# EAGLE design AudioAmplifier (EAGLE 6.5.0)
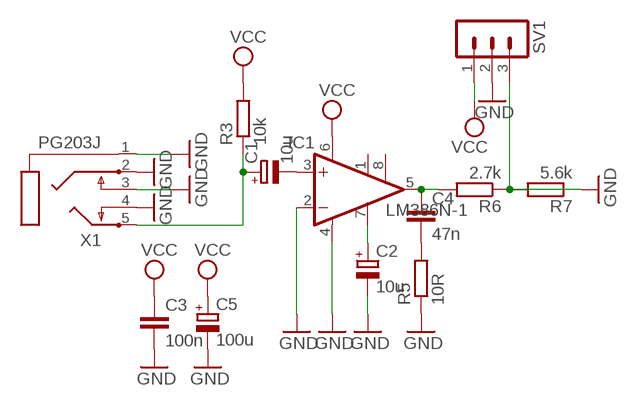
[diagram p0: schematic, sheet 1]

## Parts
C1  10u  CPOL-EUTT2D5  [TT2D5]
C2  10u  CPOL-EUTT2D5  [TT2D5]
C3  100n  C-EU025-024X044  [C025-024X044]
C4  47n  C-EU025-024X044  [C025-024X044]
C5  100u  CPOL-EUTT2D5  [TT2D5]
IC1  LM386N-1  [DIL08]
R3  10k  R-EU_0204/7  [0204/7]
R5  10R  R-EU_0207/2V  [0207/2V]
R6  2.7k  R-EU_0207/2V  [0207/2V]
R7  5.6k  R-EU_0207/2V  [0207/2V]
SV1  MA03-1  [MA03-1]
X1  PG203J  [PG203J]

## Nets
GND: C2.- C3.2 C5.- IC1.2(-IN) IC1.4(GND) R5.1 R7.2 SV1.2 X1.1 X1.2 X1.3 X1.4
N$1: R6.1 R7.1 SV1.3
N$28: C1.- IC1.3(+IN)
N$101: C2.+ IC1.7(BYPASS)
N$102: C4.1 IC1.5(OUT) R6.2
N$103: C4.2 R5.2
N$105: C1.+ R3.1 X1.5
VCC: C3.1 C5.+ IC1.6(VS) R3.2 SV1.1
Unconnected: IC1.1(GAIN) IC1.8(GAIN)

## Library data of the parts
C1 C2 C5 = rcl:CPOL-EU: POLARIZED CAPACITOR, European symbol
C3 C4 = resistor:C-EU: CAPACITOR, European symbol
IC1 = linear:LM386?-*: Low Voltage Audio Power Amplifier Source: http://cache.national.com/ds/LM/LM386.pdf
R3 R5-R7 = resistor:R-EU_: RESISTOR, European symbol
SV1 = con-lstb:MA03-1: PIN HEADER; OC_FARNELL: unknown; OC_NEWARK: unknown
X1 = con-hirschmann:PG203J: MIC/HEADPHONE JACK KS-S stereo microphone/headphone jack PG203JN (Schukat); OC_FARNELL: unknown; OC_NEWARK: unknown

## Net classes
0 default: width 0.305 mm, clearance 0.205 mm

## Board
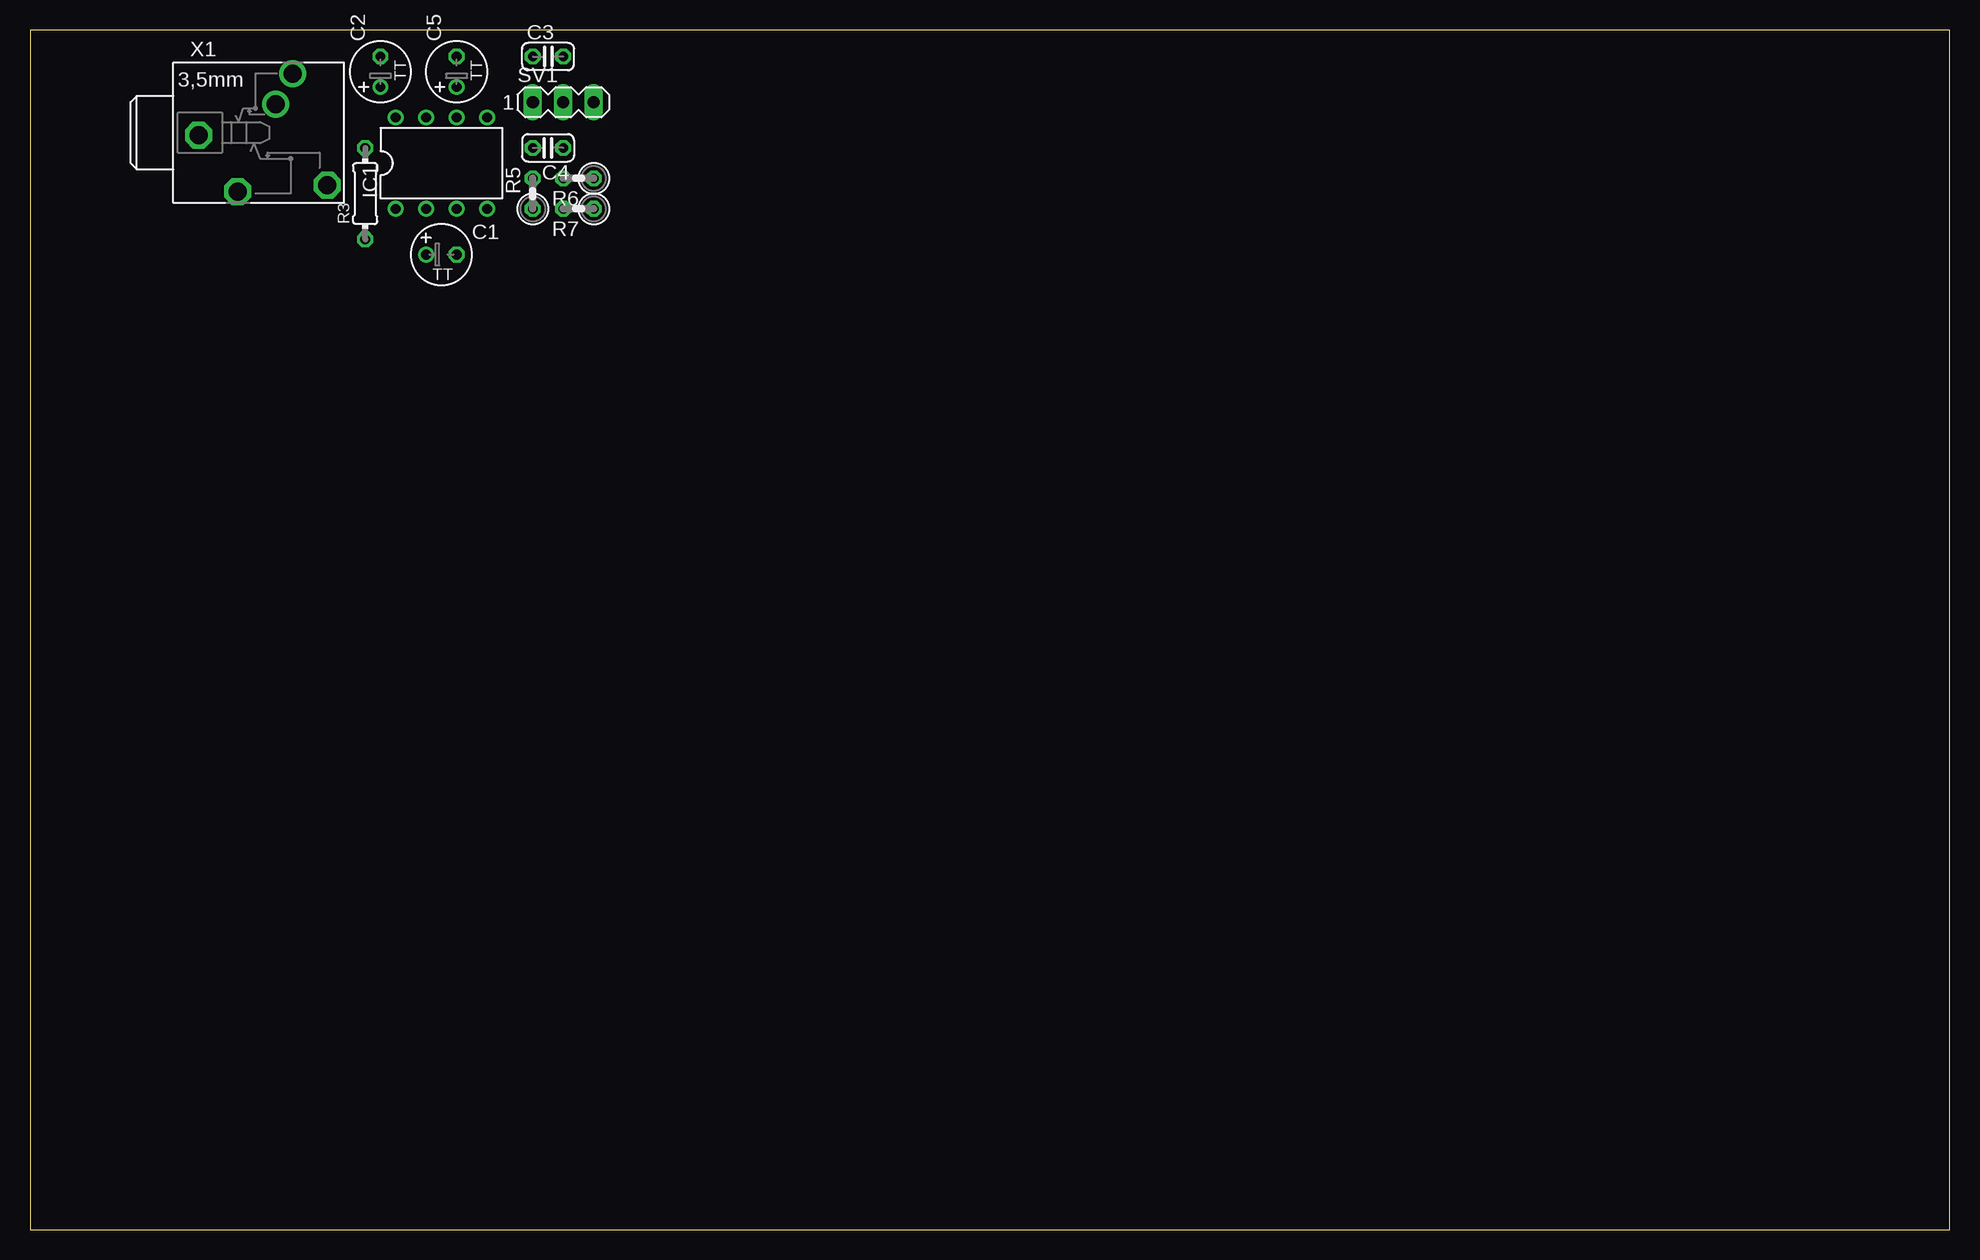
[diagram p1: board, top side]
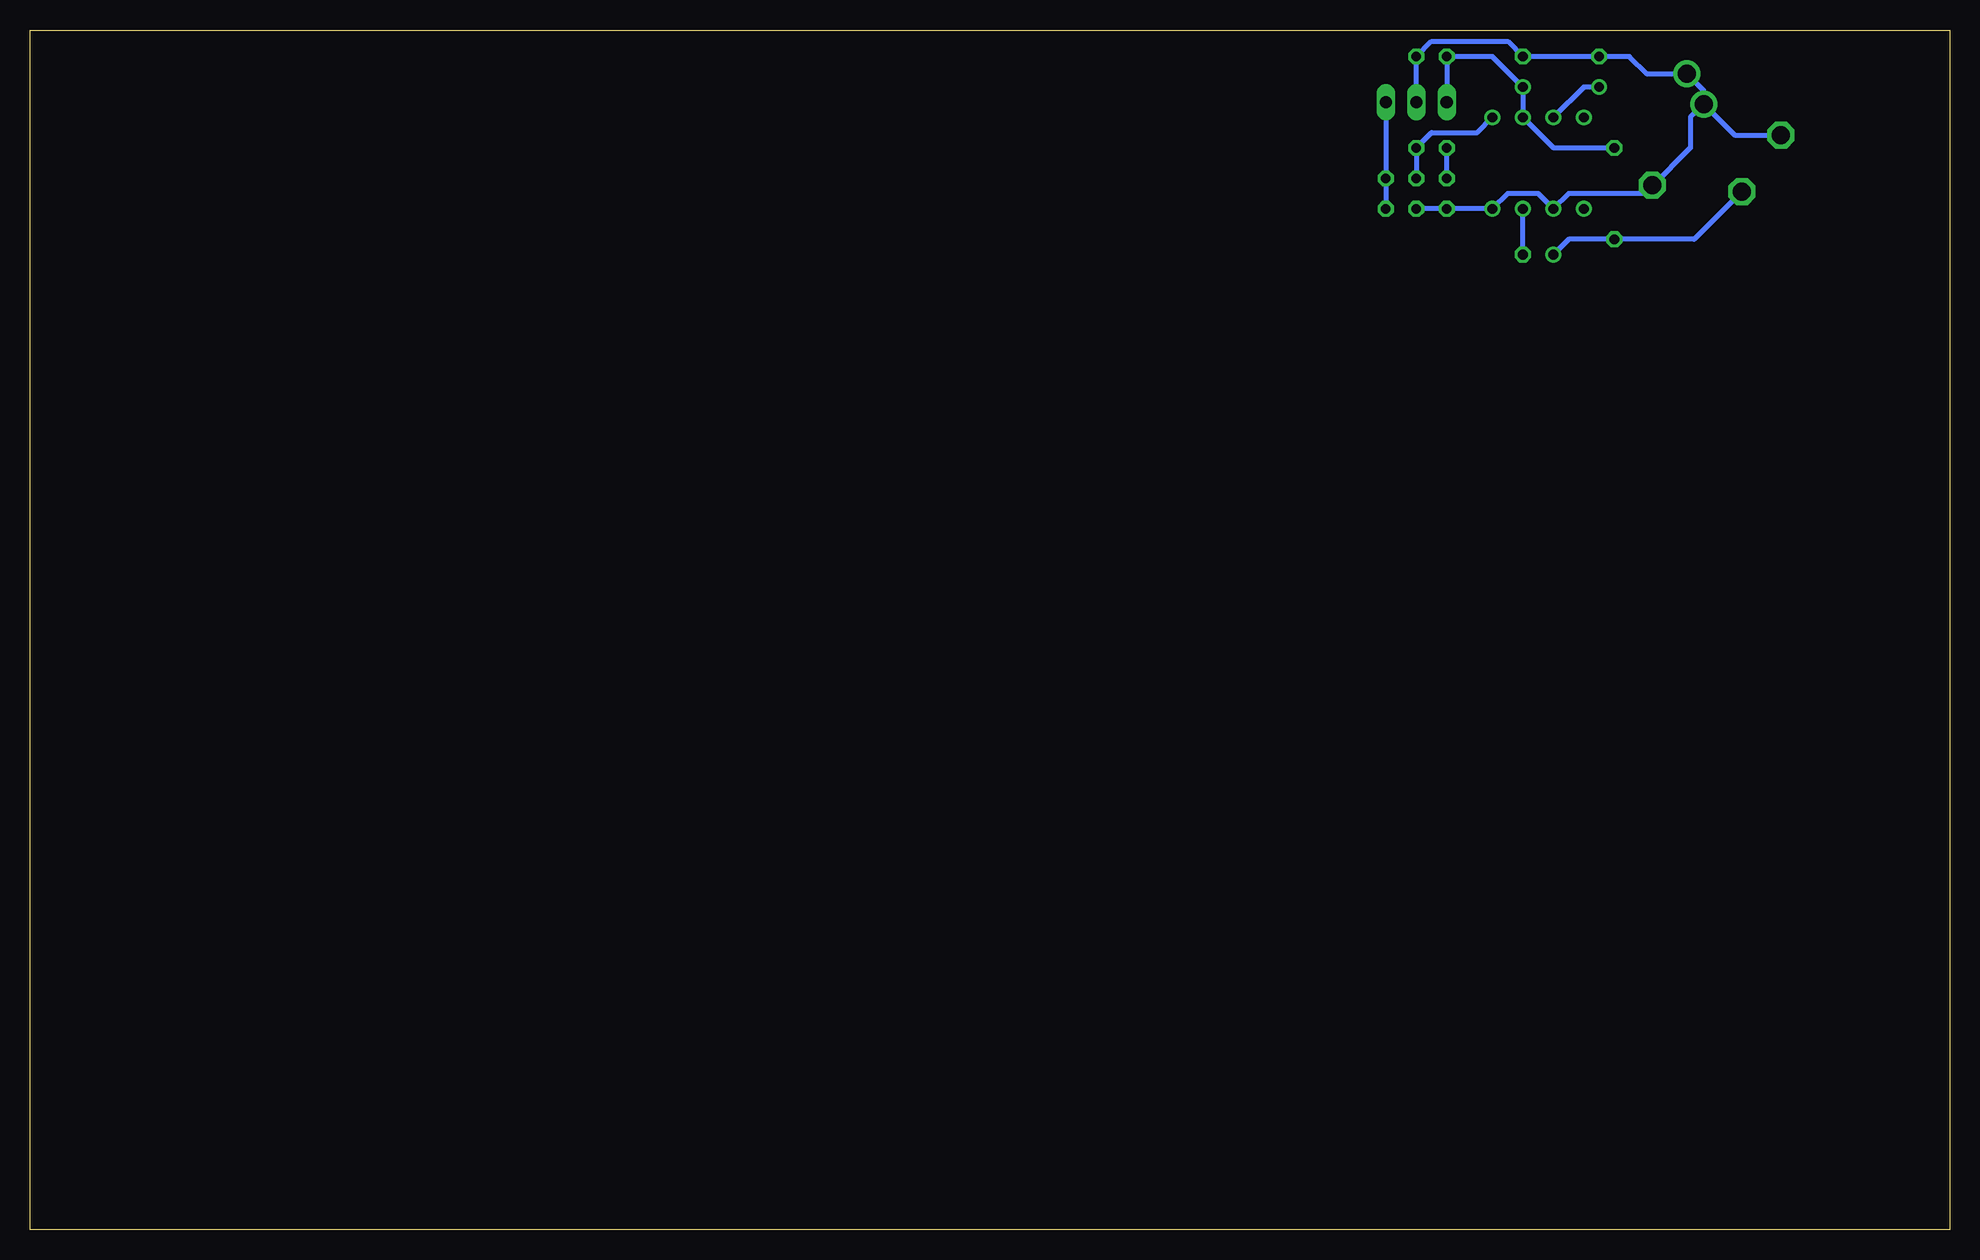
[diagram p2: board, bottom side, seen from below]

Size 160 x 100 mm. Coordinates in mm from the lower left corner, seen from the top.
Outline: 0,0 160,0 160,100 0,100 0,0
Copper layers (1*16): Top 0.035mm / dielectric 1.5mm / Bottom 0.035mm
Design rules "default": minimum track width 10mil, minimum drill 24mil, track to track 8mil, track to pad 8mil, pad to pad 8mil, via to via 8mil, smd to smd 8mil, copper to edge 40mil, drill to drill 8mil, minimum pad ring 10mil, minimum via ring 8mil, stop-mask expansion 4mil, vias tented up to drill 0mil, thermal gap 10mil

### Footprints (pad centres in the part's own frame; a part is rotated, then mirrored left to right if it is on the bottom)
TT2D5 = drill 0.813: + -1.27,0 | drill 0.813 octagon: - 1.27,0
C025-024X044 = drill 0.813 octagon: 1 -1.27,0; 2 1.27,0
DIL08 = drill 0.813 pad 1.27: 1 -3.81,-3.81; 2 -1.27,-3.81; 3 1.27,-3.81; 4 3.81,-3.81; 5 3.81,3.81; 6 1.27,3.81; 7 -1.27,3.81; 8 -3.81,3.81
0204/7 = drill 0.813 octagon: 1 -3.81,0; 2 3.81,0
0207/2V = drill 0.813 octagon: 1 -1.27,0; 2 1.27,0
MA03-1 = drill 1.016 long: 1 -2.54,0; 2 0,0; 3 2.54,0
PG203J = drill 1.499 octagon: 1 -5.004,-0.203; 4 5.74,-4.369; 5 -1.753,-4.902 | drill 1.499: 2 2.845,4.902; 3 1.448,2.388

### Placement (x,y rotation side)
C1  34.29,81.28 0 top
C2  29.21,96.52 90 top
C3  43.18,97.79 0 top
C4  43.18,90.17 180 top
C5  35.56,96.52 90 top
IC1  34.29,88.9 0 top
R3  27.94,86.36 90 top
R5  41.91,86.36 90 top
R6  45.72,87.63 180 top
R7  45.72,85.09 180 top
SV1  44.45,93.98 0 top
X1  19.05,91.44 0 top

### Tracks (layer width: path | path; a pad name or v marks a point on that pad's centre or on a via)
GND
  Bottom 0.406: SV1.2 C3.2 43.18,99.06 36.83,99.06 C5.- C2.- 26.67,97.79 25.22,96.34 X1.2 20.5,94.94 X1.3 | X1.3 17.91,91.24 X1.1 | X1.3 21.59,92.73 21.59,90.17 24.79,86.97 | R7.2 R5.1 IC1.4 36.83,86.36 34.29,86.36 IC1.2 31.75,86.36 25.4,86.36 24.79,86.97 | 24.79,86.97 X1.4
N$1
  Bottom 0.406: SV1.3 R6.1 R7.1
N$28
  Bottom 0.406: C1.- IC1.3
N$101
  Bottom 0.406: C2.+ 30.48,95.25 IC1.7
N$102
  Bottom 0.406: R6.2 C4.1 43.18,91.44 39.37,91.44 IC1.5
N$103
  Bottom 0.406: R5.2 C4.2
N$105
  Bottom 0.406: X1.5 21.29,82.55 R3.1 31.75,82.55 C1.+
VCC
  Bottom 0.406: SV1.1 C3.1 38.1,97.79 C5.+ IC1.6 33.02,90.17 R3.2